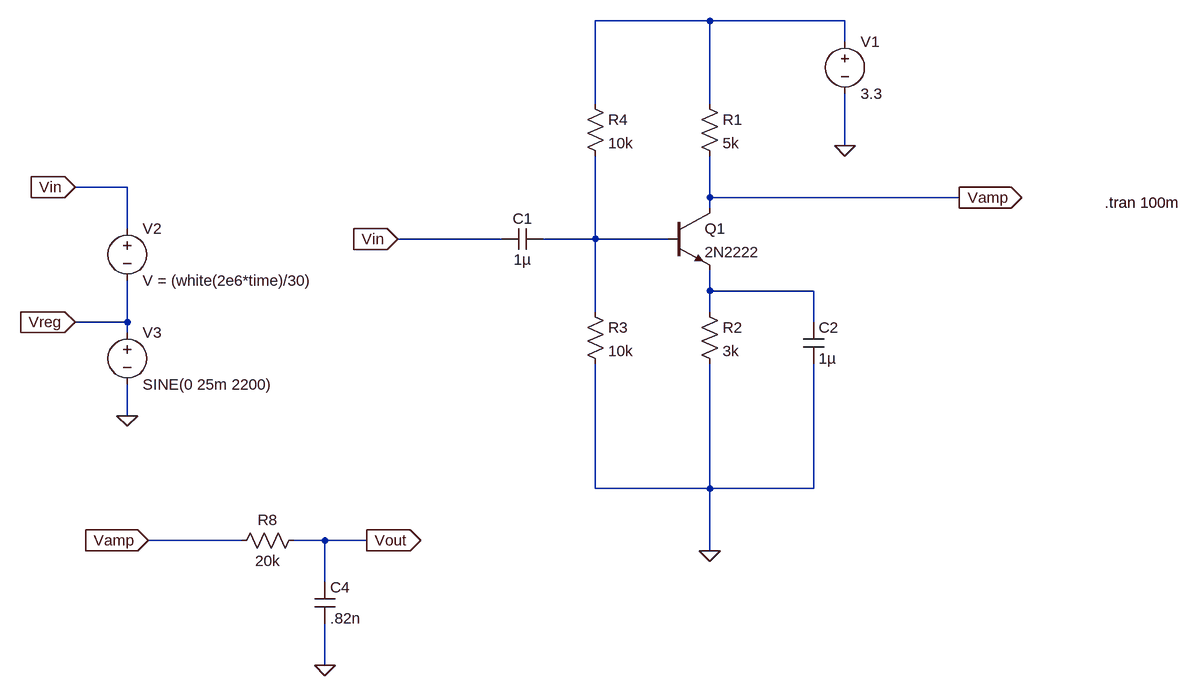
[diagram p0: schematic Rx_circuit1.asc]
Rx_circuit1.asc, the LTspice schematic file:
Version 4
SHEET 1 1364 900
WIRE 80 -240 -96 -240
WIRE 288 -240 80 -240
WIRE 288 -208 288 -240
WIRE -96 -112 -96 -240
WIRE 80 -112 80 -240
WIRE 288 -48 288 -128
WIRE -816 16 -896 16
WIRE 80 32 80 -32
WIRE 464 32 80 32
WIRE 80 48 80 32
WIRE -816 80 -816 16
WIRE -240 96 -400 96
WIRE -96 96 -96 -32
WIRE -96 96 -176 96
WIRE 16 96 -96 96
WIRE 80 176 80 144
WIRE 240 176 80 176
WIRE -96 208 -96 96
WIRE 80 208 80 176
WIRE -816 224 -816 160
WIRE -816 224 -896 224
WIRE 240 224 240 176
WIRE -816 240 -816 224
WIRE -816 368 -816 320
WIRE -96 480 -96 288
WIRE 80 480 80 288
WIRE 80 480 -96 480
WIRE 240 480 240 288
WIRE 240 480 80 480
WIRE -640 560 -784 560
WIRE -512 560 -560 560
WIRE -448 560 -512 560
WIRE 80 576 80 480
WIRE -512 624 -512 560
WIRE -512 752 -512 688
FLAG 288 -48 0
FLAG 80 576 0
FLAG 464 32 Vamp
IOPIN 464 32 Out
FLAG -896 16 Vin
IOPIN -896 16 In
FLAG -512 752 0
FLAG -784 560 Vamp
IOPIN -784 560 In
FLAG -448 560 Vout
IOPIN -448 560 Out
FLAG -400 96 Vin
IOPIN -400 96 In
FLAG -816 368 0
FLAG -896 224 Vreg
IOPIN -896 224 In
DATAFLAG -512 560 ""
DATAFLAG -496 560 ""
DATAFLAG -688 560 ""
DATAFLAG -512 560 ""
SYMBOL npn 16 48 R0
SYMATTR InstName Q1
SYMATTR Value 2N2222
SYMBOL res 64 -128 R0
SYMATTR InstName R1
SYMATTR Value 5k
SYMBOL res 64 192 R0
SYMATTR InstName R2
SYMATTR Value 3k
SYMBOL res -112 192 R0
SYMATTR InstName R3
SYMATTR Value 10k
SYMBOL res -112 -128 R0
SYMATTR InstName R4
SYMATTR Value 10k
SYMBOL cap 224 224 R0
SYMATTR InstName C2
SYMATTR Value 1µ
SYMBOL cap -176 80 R90
WINDOW 0 0 32 VBottom 2
WINDOW 3 32 32 VTop 2
SYMATTR InstName C1
SYMATTR Value 1µ
SYMBOL voltage 288 -224 R0
WINDOW 123 0 0 Left 0
WINDOW 39 0 0 Left 0
SYMATTR InstName V1
SYMATTR Value 3.3
SYMBOL voltage -816 64 R0
SYMATTR InstName V2
SYMATTR Value V = (white(2e6*time)/30)
SYMATTR Prefix B
SYMBOL res -544 544 R90
WINDOW 0 0 56 VBottom 2
WINDOW 3 32 56 VTop 2
SYMATTR InstName R8
SYMATTR Value 20k
SYMBOL cap -528 624 R0
SYMATTR InstName C4
SYMATTR Value .82n
SYMBOL voltage -816 224 R0
WINDOW 123 0 0 Left 0
WINDOW 39 0 0 Left 0
SYMATTR InstName V3
SYMATTR Value SINE(0 25m 2200)
TEXT 688 40 Left 2 !.tran 100m

The netlist it stands for:
* Rx_circuit1.asc
Q1 Vamp N002 N003 0 2N2222
R1 N001 Vamp 5k
R2 N003 0 3k
R3 N002 0 10k
R4 N001 N002 10k
C2 N003 0 1µ
C1 N002 Vin 1µ
V1 N001 0 3.3
B§V2 Vin Vreg V = (white(2e6*time)/30)
R8 Vout Vamp 20k
C4 Vout 0 .82n
V3 Vreg 0 SINE(0 25m 2200)
.model NPN NPN
.model PNP PNP
.lib standard.bjt
.tran 100m
.backanno
.end